# EAGLE design G882X (EAGLE 6.6.0)
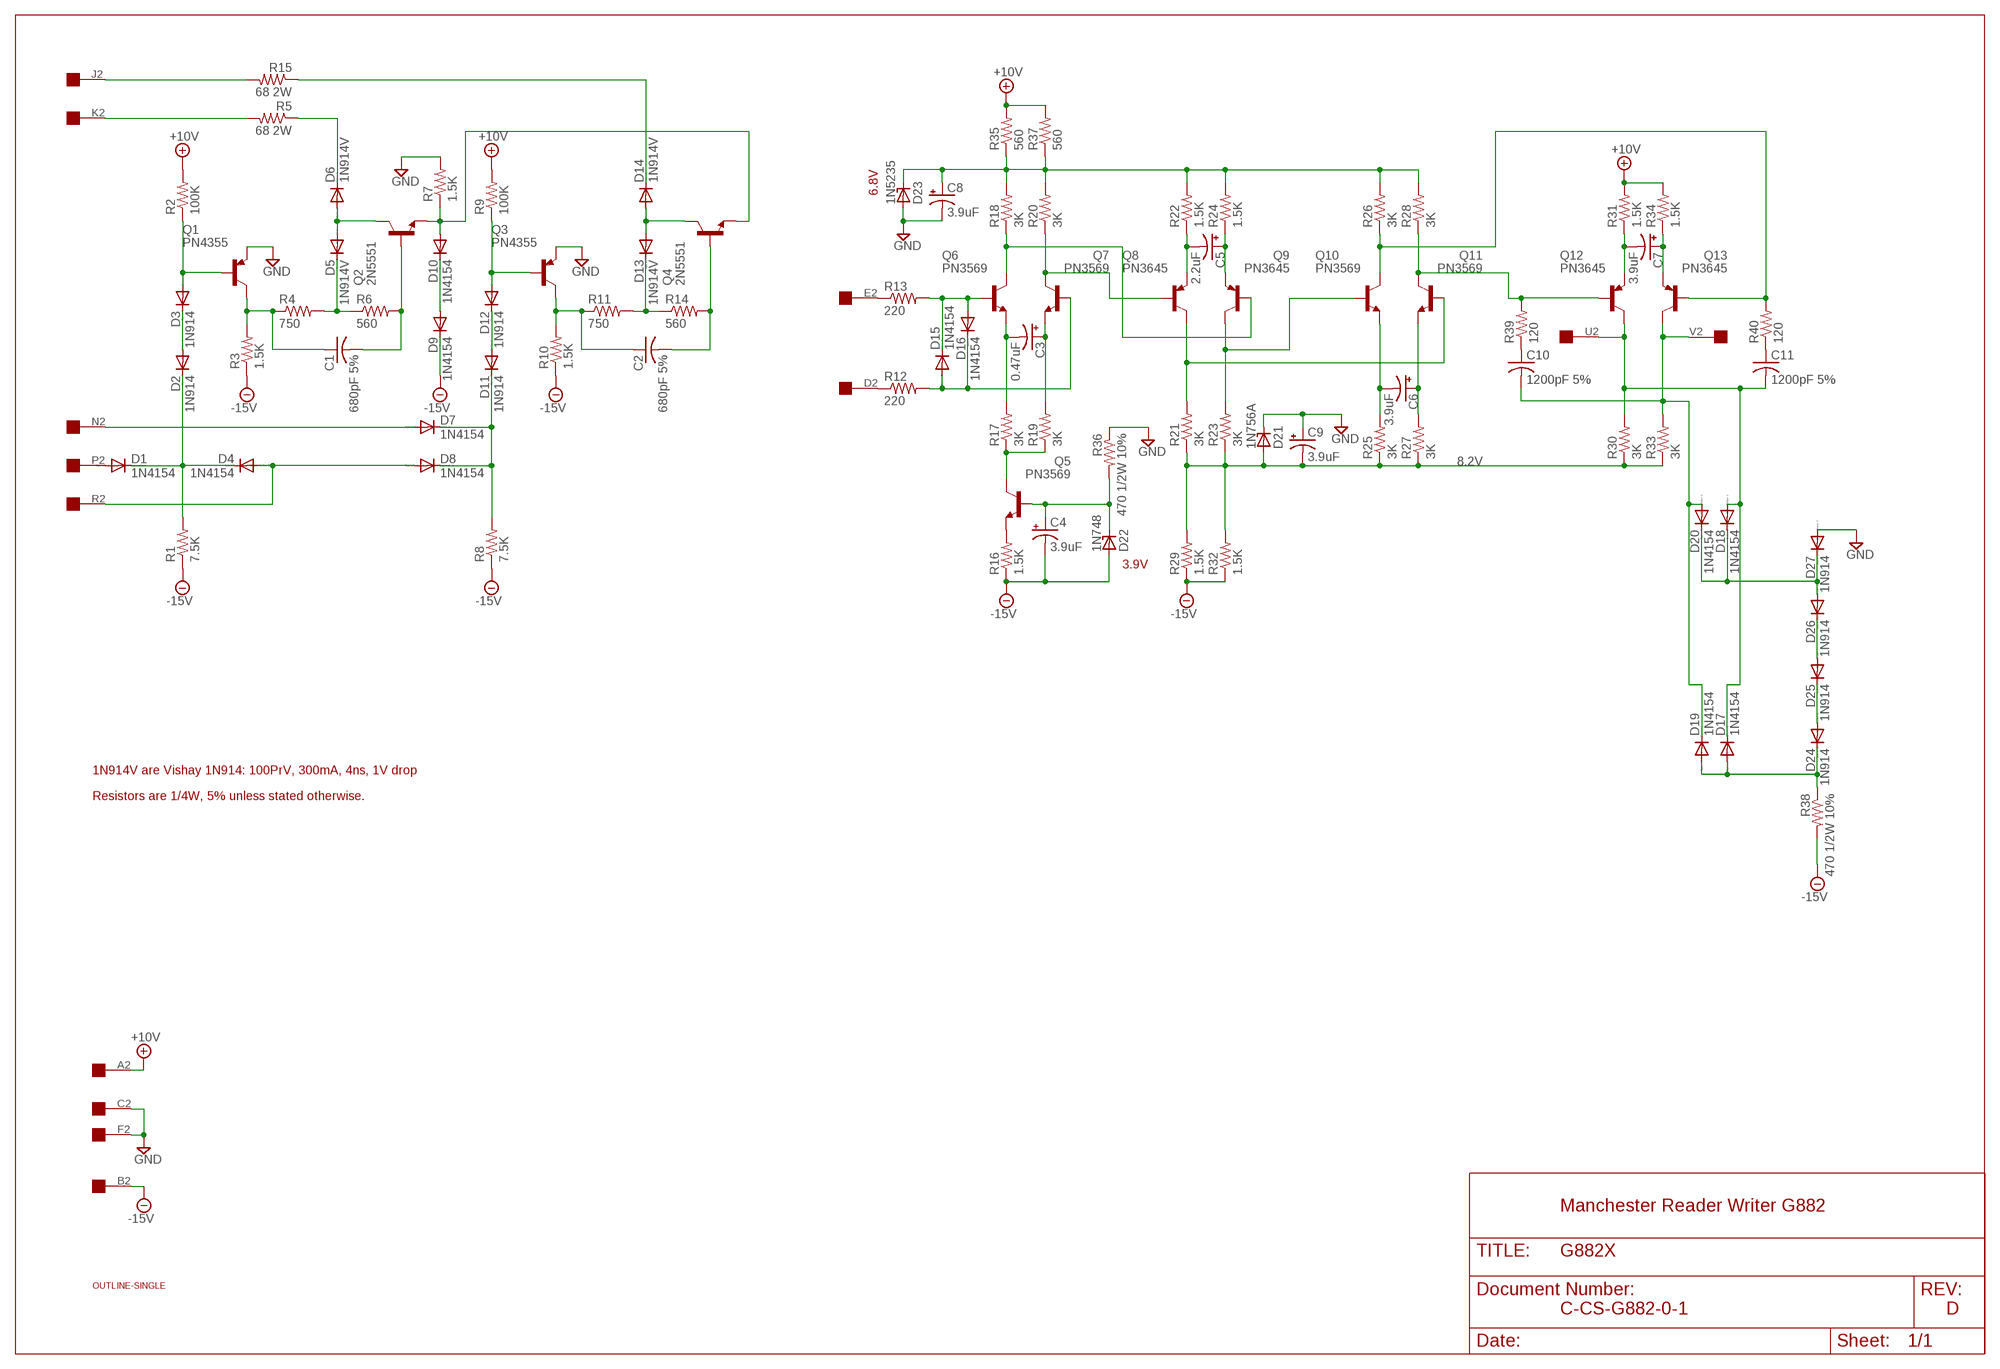
[diagram p0: schematic, sheet 1]

## Parts
C1  680pF 5%  C-US050-025X075  [C050-025X075]
C2  680pF 5%  C-US050-025X075  [C050-025X075]
C3  0.47uF  CPOL-USE12-4AXIAL  [E12-4]
C4  3.9uF  CPOL-USE12-4AXIAL  [E12-4]
C5  2.2uF  CPOL-USE12-4AXIAL  [E12-4]
C6  3.9uF  CPOL-USE12-4AXIAL  [E12-4]
C7  3.9uF  CPOL-USE12-4AXIAL  [E12-4]
C8  3.9uF  CPOL-USE12-4AXIAL  [E12-4]
C9  3.9uF  CPOL-USE12-4AXIAL  [E12-4]
C10  1200pF 5%  C-US050-025X075  [C050-025X075]
C11  1200pF 5%  C-US050-025X075  [C050-025X075]
D1  1N4154  1N4148DO35-10  [DO35-10]
D2  1N914  1N4148DO35-10  [DO35-10]
D3  1N914  1N4148DO35-10  [DO35-10]
D4  1N4154  1N4148DO35-10  [DO35-10]
D5  1N914V  1N4148DO35-10  [DO35-10]
D6  1N914V  1N4148DO35-10  [DO35-10]
D7  1N4154  1N4148DO35-10  [DO35-10]
D8  1N4154  1N4148DO35-10  [DO35-10]
D9  1N4154  1N4148DO35-10  [DO35-10]
D10  1N4154  1N4148DO35-10  [DO35-10]
D11  1N914  1N4148DO35-10  [DO35-10]
D12  1N914  1N4148DO35-10  [DO35-10]
D13  1N914V  1N4148DO35-10  [DO35-10]
D14  1N914V  1N4148DO35-10  [DO35-10]
D15  1N4154  1N4148DO35-10  [DO35-10]
D16  1N4154  1N4148DO35-10  [DO35-10]
D17  1N4154  1N4148DO35-10  [DO35-10]
D18  1N4154  1N4148DO35-10  [DO35-10]
D19  1N4154  1N4148DO35-10  [DO35-10]
D20  1N4154  1N4148DO35-10  [DO35-10]
D21  1N756A  ZENER-DIODEDO35Z10  [DO35Z10]
D22  1N748  ZENER-DIODEDO35Z10  [DO35Z10]
D23  1N5235  ZENER-DIODEDO35Z10  [DO35Z10]
D24  1N914  1N4148DO35-10  [DO35-10]
D25  1N914  1N4148DO35-10  [DO35-10]
D26  1N914  1N4148DO35-10  [DO35-10]
D27  1N914  1N4148DO35-10  [DO35-10]
Q1  PN4355  2N3635  [TO39]
Q2  2N5551  2N2102  [TO5]
Q3  PN4355  2N3635  [TO39]
Q4  2N5551  2N2102  [TO5]
Q5  PN3569  2N2102  [TO5]
Q6  PN3569  2N2102  [TO5]
Q7  PN3569  2N2102  [TO5]
Q8  PN3645  2N3635  [TO39]
Q9  PN3645  2N3635  [TO39]
Q10  PN3569  2N2102  [TO5]
Q11  PN3569  2N2102  [TO5]
Q12  PN3645  2N3635  [TO39]
Q13  PN3645  2N3635  [TO39]
R1  7.5K  R-US_0207/10  [0207/10]
R2  100K  R-US_0207/10  [0207/10]
R3  1.5K  R-US_0207/10  [0207/10]
R4  750  R-US_0207/10  [0207/10]
R5  68 2W  R-US_0817/22  [P0817/22]
R6  560  R-US_0207/10  [0207/10]
R7  1.5K  R-US_0207/10  [0207/10]
R8  7.5K  R-US_0207/10  [0207/10]
R9  100K  R-US_0207/10  [0207/10]
R10  1.5K  R-US_0207/10  [0207/10]
R11  750  R-US_0207/10  [0207/10]
R12  220  R-US_0207/10  [0207/10]
R13  220  R-US_0207/10  [0207/10]
R14  560  R-US_0207/10  [0207/10]
R15  68 2W  R-US_0817/22  [P0817/22]
R16  1.5K  R-US_0207/10  [0207/10]
R17  3K  R-US_0207/10  [0207/10]
R18  3K  R-US_0207/10  [0207/10]
R19  3K  R-US_0207/10  [0207/10]
R20  3K  R-US_0207/10  [0207/10]
R21  3K  R-US_0207/10  [0207/10]
R22  1.5K  R-US_0207/10  [0207/10]
R23  3K  R-US_0207/10  [0207/10]
R24  1.5K  R-US_0207/10  [0207/10]
R25  3K  R-US_0207/10  [0207/10]
R26  3K  R-US_0207/10  [0207/10]
R27  3K  R-US_0207/10  [0207/10]
R28  3K  R-US_0207/10  [0207/10]
R29  1.5K  R-US_0207/10  [0207/10]
R30  3K  R-US_0207/10  [0207/10]
R31  1.5K  R-US_0207/10  [0207/10]
R32  1.5K  R-US_0207/10  [0207/10]
R33  3K  R-US_0207/10  [0207/10]
R34  1.5K  R-US_0207/10  [0207/10]
R35  560  R-US_0207/10  [0207/10]
R36  470 1/2W 10%  R-US_0309/12  [0309/12]
R37  560  R-US_0207/10  [0207/10]
R38  470 1/2W 10%  R-US_0309/12  [0309/12]
R39  120  R-US_0207/10  [0207/10]
R40  120  R-US_0207/10  [0207/10]
U$1  OUTLINE-SINGLE  [SINGLE]
U$2  EDGE-1  [EDGE-CON1]

## Nets
8.2V: C9.- D21.A R21.1 R23.1 R25.1 R27.1 R29.2 R30.1 R32.2 R33.1
+10V [Supply]: R2.2 R9.2 R31.2 R34.2 R35.2 R37.2 U$2.A2
-15V [Supply]: C4.- D9.C D22.A R1.1 R3.1 R8.1 R10.1 R16.1 R29.1 R32.1 R38.2 U$2.B2
GND [Supply]: C8.- C9.+ D21.C D23.A D27.A Q1.1(E) Q3.1(E) R7.2 R36.1 U$2.C2 U$2.F2
N$1: D1.A U$2.P2
N$2: D11.A D12.C
N$3: D4.A D8.A U$2.R2
N$4: D7.A U$2.N2
N$5: C1.1 Q1.3(C) R3.2 R4.1
N$6: D1.C D2.C D4.C R1.2
N$7: D5.C R4.2 R6.1
N$8: D7.C D8.C D11.C R8.2
N$9: D12.A Q3.2(B) R9.1
N$10: D2.A D3.C
N$11: D5.A D6.A Q2.3(C)
N$12: R5.2 U$2.K2
N$13: D6.C R5.1
N$14: D3.A Q1.2(B) R2.1
N$15: C1.2 Q2.2(B) R6.2
N$16: D10.A Q2.1(E) Q4.1(E) R7.1
N$17: D9.A D10.C
N$18: R15.2 U$2.J2
N$19: C2.1 Q3.3(C) R10.2 R11.1
N$20: D13.C R11.2 R14.1
N$21: D13.A D14.A Q4.3(C)
N$22: D14.C R15.1
N$23: C2.2 Q4.2(B) R14.2
N$24: R13.1 U$2.E2
N$25: R12.1 U$2.D2
N$26: D15.A D16.C Q7.2(B) R12.2
N$27: D15.C D16.A Q6.2(B) R13.2
N$28: C3.- Q6.1(E) R17.2
N$29: C3.+ Q7.1(E) R19.2
N$30: Q5.3(C) R17.1 R19.1
N$31: Q5.1(E) R16.2
N$32: C4.+ D22.C Q5.2(B) R36.2
N$33: C8.+ D23.C R18.2 R20.2 R22.2 R24.2 R26.2 R28.2 R35.1 R37.1
N$34: C5.- Q8.1(E) R22.1
N$35: Q7.3(C) Q8.2(B) R20.1
N$36: Q6.3(C) Q9.2(B) R18.1
N$37: C5.+ Q9.1(E) R24.1
N$38: Q8.3(C) Q11.2(B) R21.2
N$39: Q9.3(C) Q10.2(B) R23.2
N$41: C6.- Q10.1(E) R25.2
N$42: C6.+ Q11.1(E) R27.2
N$43: Q11.3(C) Q12.2(B) R28.1 R39.2
N$44: Q10.3(C) Q13.2(B) R26.1 R40.2
N$45: C7.- Q12.1(E) R31.1
N$46: C7.+ Q13.1(E) R34.1
N$47: C11.2 D17.C D18.A Q12.3(C) R30.2 U$2.U2
N$48: C10.2 D19.C D20.A Q13.3(C) R33.2 U$2.V2
N$49: D17.A D19.A D24.C R38.1
N$50: D24.A D25.C
N$51: D25.A D26.C
N$52: D18.C D20.C D26.A D27.C
N$53: C10.1 R39.1
N$55: C11.1 R40.1
Unconnected: U$2.H2 U$2.L2 U$2.M2 U$2.S2 U$2.T2

## Notes on the sheet
- 6.8V
- 3.9V
- 1N914V are Vishay 1N914: 100PrV, 300mA, 4ns, 1V drop
- Resistors are 1/4W, 5% unless stated otherwise.
- Manchester Reader Writer G882
- C-CS-G882-0-1 | D

## Library data of the parts
C1 C2 C10 C11 = rcl:C-US: CAPACITOR, American symbol
C3-C9 = dec-con:CPOL-USE12-4AXIAL: 0.5" veresion of an electrolytic
D1-D20 D24-D27 = diode:1N4148: DIODE high speed (Philips)
D21-D23 = diode:ZENER-DIODE: Z-Diode
Q1 Q3 Q8 Q9 Q12 Q13 = transistor-pnp:2N3635*: PNP Transistror
Q2 Q4-Q7 Q10 Q11 = transistor-npn:2N2102: NPN Transistor
R1-R40 = rcl:R-US_: RESISTOR, American symbol
U$1 = dec-con:OUTLINE-*: Board outlines for DEC boards.
U$2 = dec-con:EDGE-1: Single-Sided DEC Edge Connector -- (side 2)

## Net classes
1 Supply: width 0.813 mm

## Board
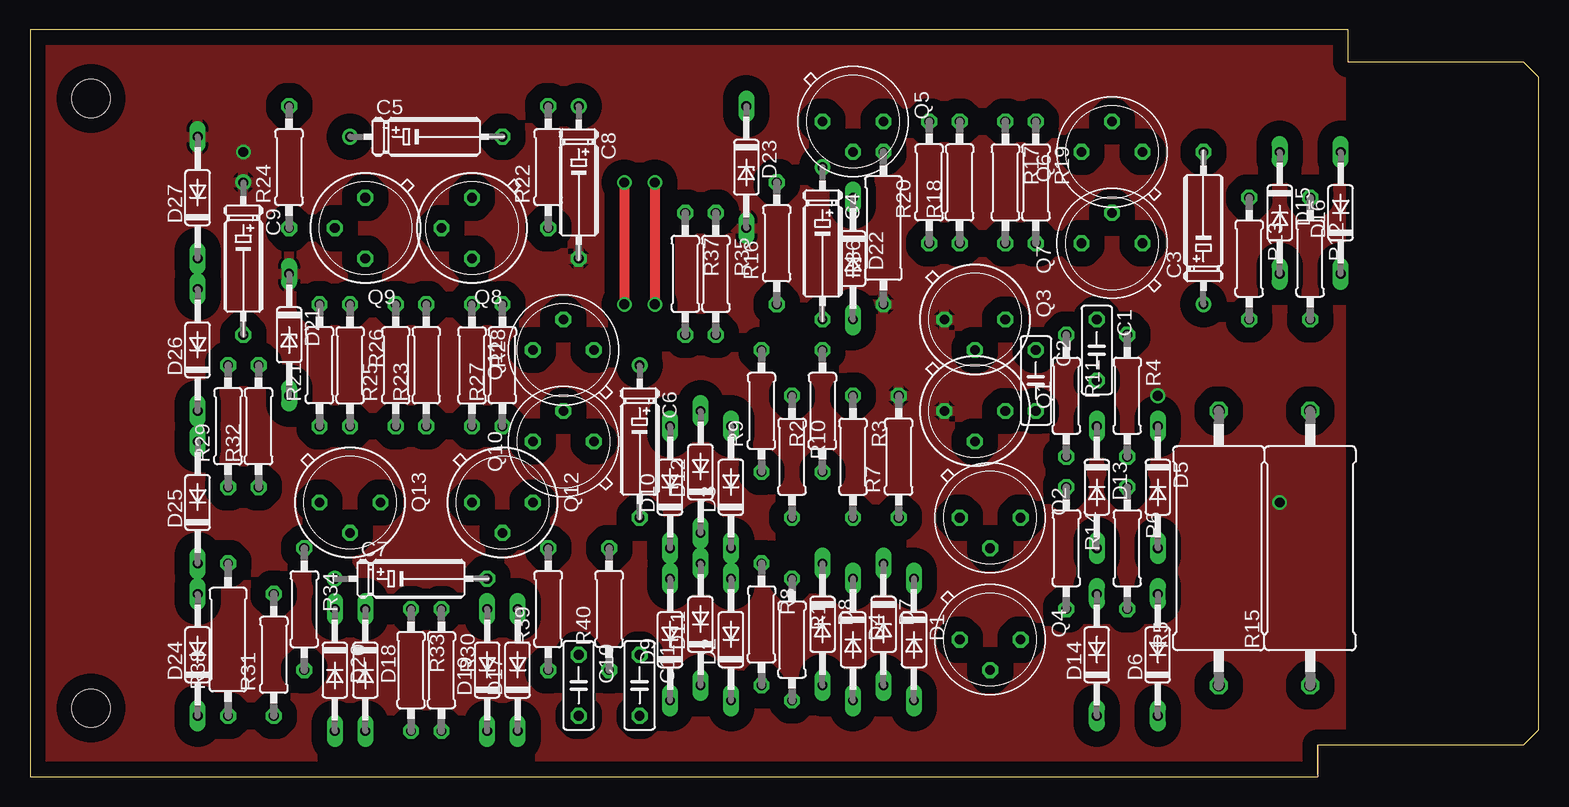
[diagram p1: board, top side]
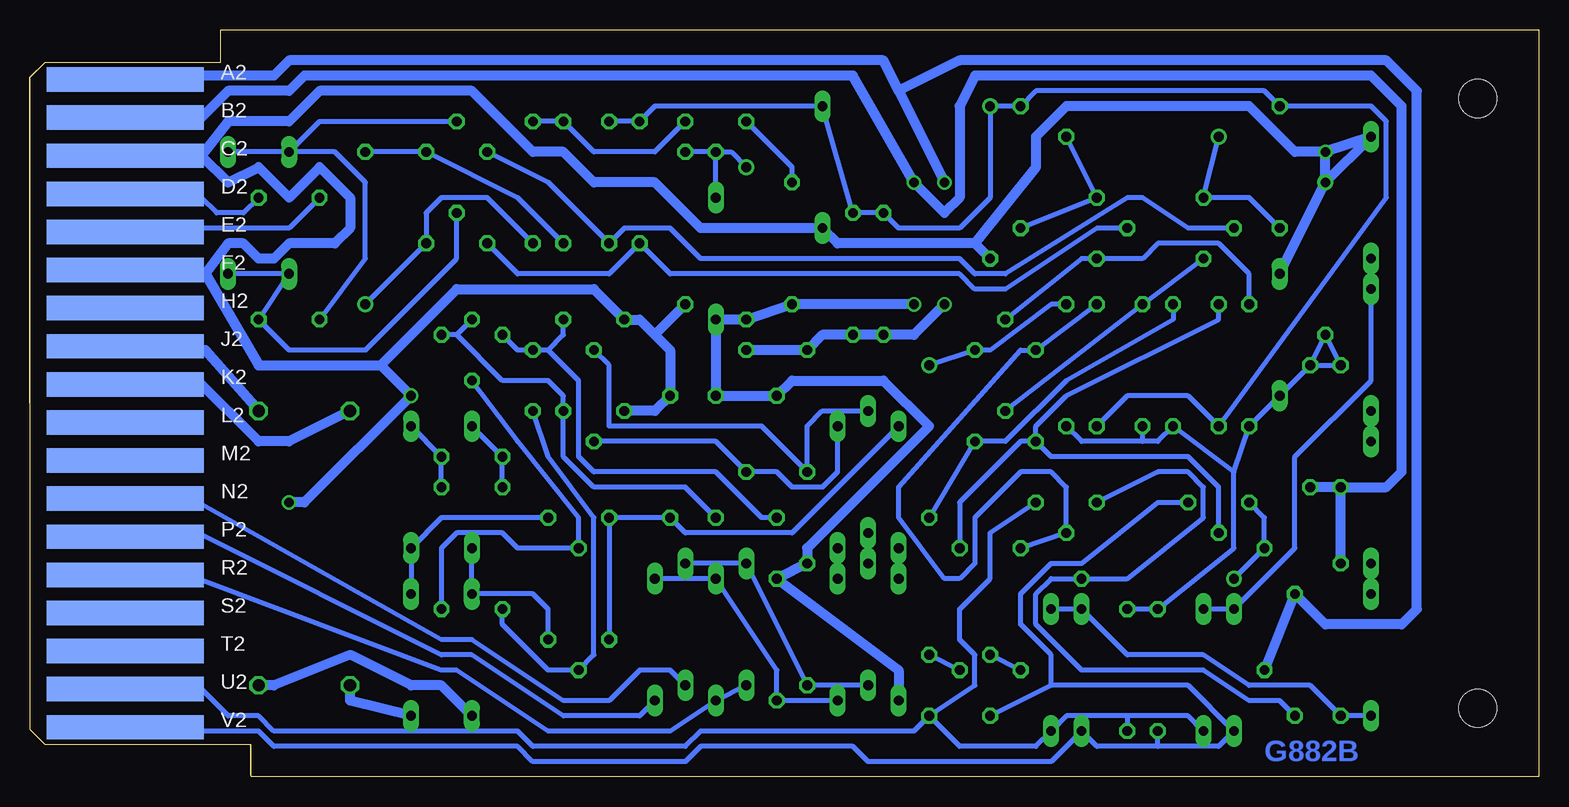
[diagram p2: board, bottom side, seen from below]

Size 125.73 x 62.23 mm. Coordinates in mm from the lower left corner, seen from the top.
Copper layers (1+16): Top 0.035mm / dielectric 1.5mm / Bottom 0.035mm
Design rules "16mils": minimum track width 16mil, minimum drill 32mil, track to track 15mil, track to pad 10mil, pad to pad 10mil, via to via 10mil, smd to smd 10mil, copper to edge 13mil, drill to drill 10mil, minimum pad ring 10mil, minimum via ring 8mil, stop-mask expansion 0mil, vias tented up to drill 0mil, thermal gap 10mil

### Footprints (pad centres in the part's own frame; a part is rotated, then mirrored left to right if it is on the bottom)
C050-025X075 = drill 0.813 octagon: 1 -2.54,0; 2 2.54,0
E12-4 = drill 0.813: + -7.62,0 | drill 0.813 octagon: - 5.08,0
DO35-10 = drill 0.813 long: A 5.08,0; C -5.08,0
DO35Z10 = drill 0.813 long: A 5.08,0; C -5.08,0
TO39 = drill 0.813 octagon: 1 0,-2.54; 2 2.54,0; 3 0,2.54
TO5 = drill 0.813 octagon: 1 0,-2.54; 2 2.54,0; 3 0,2.54
0207/10 = drill 0.813 octagon: 1 -5.08,0; 2 5.08,0
P0817/22 = drill 1.016 octagon: 1 -11.43,0; 2 11.43,0
0309/12 = drill 0.813 octagon: 1 -6.35,0; 2 6.35,0
SINGLE = hole 3.175: 120.65,56.515; 120.65,5.715
EDGE-CON1 = smd 13.106 x 2.032 bottom: A2 7.938,4.128; B2 7.938,7.303; C2 7.938,10.477; D2 7.938,13.652; E2 7.938,16.828; F2 7.938,20.003; H2 7.938,23.177; J2 7.938,26.352; K2 7.938,29.527; L2 7.938,32.703; M2 7.938,35.877; N2 7.938,39.053; P2 7.938,42.227; R2 7.938,45.403; S2 7.938,48.578; T2 7.938,51.752; U2 7.938,54.928; V2 7.938,58.102

### Placement (x,y rotation side)
C1  88.9,35.56 270 top
C2  83.82,33.02 270 top
C3  97.79,46.99 90 top
C4  66.04,43.18 270 top
C5  34.29,53.34 0 top
C6  50.8,26.67 270 top
C7  33.02,16.51 0 top
C8  45.72,48.26 270 top
C9  17.78,41.91 270 top
C10  45.72,7.62 270 top
C11  50.8,7.62 270 top
D1  73.66,11.43 270 top
D2  58.42,11.43 90 top
D3  58.42,24.13 90 top
D4  68.58,11.43 270 top
D5  93.98,24.13 270 top
D6  93.98,10.16 90 top
D7  71.12,12.7 270 top
D8  66.04,12.7 270 top
D9  53.34,11.43 90 top
D10  53.34,24.13 90 top
D11  55.88,12.7 90 top
D12  55.88,25.4 90 top
D13  88.9,24.13 270 top
D14  88.9,10.16 90 top
D15  104.14,46.99 270 top
D16  109.22,46.99 90 top
D17  40.64,8.89 90 top
D18  27.94,8.89 270 top
D19  38.1,8.89 90 top
D20  25.4,8.89 270 top
D21  21.59,36.83 270 top
D22  68.58,43.18 270 top
D23  59.69,50.8 270 top
D24  13.97,10.16 90 top
D25  13.97,22.86 90 top
D26  13.97,35.56 90 top
D27  13.97,48.26 90 top
Q1  78.74,30.48 270 top
Q2  80.01,21.59 270 top
Q3  78.74,38.1 270 top
Q4  80.01,11.43 270 top
Q5  68.58,54.61 270 top
Q6  90.17,52.07 90 top
Q7  90.17,44.45 90 top
Q8  36.83,45.72 180 top
Q9  27.94,45.72 180 top
Q10  44.45,27.94 90 top
Q11  44.45,35.56 90 top
Q12  39.37,22.86 270 top
Q13  26.67,22.86 270 top
R1  63.5,11.43 270 top
R2  66.04,30.48 90 top
R3  68.58,26.67 270 top
R4  91.44,31.75 270 top
R5  99.06,19.05 90 top
R6  91.44,19.05 270 top
R7  72.39,26.67 90 top
R8  60.96,12.7 270 top
R9  60.96,30.48 90 top
R10  63.5,26.67 270 top
R11  86.36,31.75 270 top
R12  106.68,43.18 270 top
R13  101.6,43.18 270 top
R14  86.36,19.05 270 top
R15  106.68,19.05 90 top
R16  62.23,44.45 90 top
R17  81.28,49.53 270 top
R18  77.47,49.53 90 top
R19  83.82,49.53 270 top
R20  74.93,49.53 90 top
R21  24.13,34.29 90 top
R22  43.18,50.8 90 top
R23  33.02,34.29 90 top
R24  21.59,50.8 90 top
R25  30.48,34.29 90 top
R26  26.67,34.29 270 top
R27  39.37,34.29 90 top
R28  36.83,34.29 270 top
R29  16.51,29.21 90 top
R30  34.29,8.89 270 top
R31  20.32,10.16 90 top
R32  19.05,29.21 90 top
R33  31.75,8.89 270 top
R34  22.86,13.97 270 top
R35  57.15,41.91 270 top
R36  71.12,45.72 90 top
R37  54.61,41.91 270 top
R38  16.51,11.43 90 top
R39  43.18,13.97 90 top
R40  48.26,13.97 90 top
U$1  125.73,62.23 180 top
U$2  125.73,62.23 180 top

### Tracks (layer width: path | path; a pad name or v marks a point on that pad's centre or on a via)
8.2V
  Bottom 0.406: R30.1 R33.1 25.4,19.05 25.4,25.4 | 25.4,25.4 R25.1 31.75,27.94 33.02,27.94 | 25.4,25.4 R21.1 D21.A R32.2 | R32.2 R29.2 C9.- R32.2 | R27.1 38.1,27.94 33.02,27.94 | 33.02,27.94 R23.1
+10V  (via drill 0.81)
  Top 0.813: v49.53,49.53 v49.53,39.37
  Bottom 0.813: R2.2 R9.2 59.69,36.83 R35.2 R37.2 52.07,36.83 v49.53,39.37 | U$2.A2 117.22,58.04 116.84,58.42 105.41,58.42 104.14,59.69 54.61,59.69 53.34,57.15 | 53.34,57.15 v49.53,49.53 | R34.2 R31.2 17.78,12.7 11.43,12.7 10.16,13.97 10.16,57.15 12.7,59.69 48.26,59.69 53.34,57.15
-15V  (via drill 0.81)
  Top 0.813: v52.07,49.53 v52.07,39.37
  Bottom 0.813: D9.C 53.34,8.89 R1.1 R8.1 60.96,19.05 50.8,29.21 54.61,33.02 62.23,33.02 R10.1 R3.1 D22.A C4.- R16.1 v52.07,39.37 | U$2.B2 117.13,54.9 116.84,54.61 111.76,54.61 109.22,57.15 104.14,57.15 102.87,58.42 57.15,58.42 v52.07,49.53 49.53,46.99 48.26,48.26 48.26,55.88 46.99,58.42 13.97,58.42 11.43,55.88 11.43,25.4 12.7,24.13 R29.1 | R29.1 R32.1 | R38.2 R29.1
GND  (via drill 0.81)
  Bottom 0.813: 73.66,36.83 74.93,38.1 Q3.1 78.74,40.64 90.17,40.64 96.52,34.29 | 73.66,36.83 72.39,35.56 R7.2 73.66,30.48 Q1.1 | v104.14,22.86 102.87,22.86 v93.98,31.75 96.52,34.29 | U$2.F2 117.12,42.19 116.84,41.91 111.12,41.91 | 111.12,41.91 106.68,34.29 96.52,34.29 | U$2.C2 117.17,51.74 116.84,52.07 111.44,51.75 | 111.44,51.75 109.22,49.53 106.68,50.8 104.14,48.26 101.6,50.8 99.06,48.26 99.06,45.72 100.33,44.45 104.14,44.45 105.41,43.18 106.68,43.18 107.95,44.45 109.22,44.45 111.12,41.91 | 111.44,51.75 109.22,54.61 104.14,54.61 101.6,57.15 88.9,57.15 83.82,52.07 81.28,52.07 78.74,49.53 73.66,49.53 69.85,45.72 D23.A 58.42,44.45 46.99,44.45 | 46.99,44.45 C8.- | v17.78,52.07 D27.A C9.+ | D21.C C9.+ | 46.99,44.45 41.91,50.8 41.91,53.34 39.37,55.88 24.13,55.88 20.32,52.07 v17.78,52.07 | C9.+ v17.78,52.07 | 73.66,36.83 R36.1
  pour Top (isolate 1.27): 0,62.23 109.22,62.23 109.22,0 0,0
N$1
  Bottom 0.406: D1.A 74.93,5.08 81.28,5.08 88.9,10.16 91.44,10.16 111.76,20.32 116.84,20.32 U$2.P2
N$2
  Bottom 0.406: D11.A D12.C
N$3
  Bottom 0.406: D8.A D4.A 72.39,3.81 82.55,3.81 90.17,8.89 91.44,8.89 111.76,16.51 116.84,16.51 117.17,16.84 U$2.R2
N$4
  Bottom 0.406: D7.A 72.39,8.89 74.93,8.89 77.47,6.35 81.28,6.35 88.9,11.43 91.44,11.43 111.76,22.86 116.84,22.86 117.17,23.19 U$2.N2
N$5
  Bottom 0.406: R3.2 71.12,24.13 78.74,24.13 81.28,26.67 Q1.3 81.28,31.75 82.55,33.02 86.36,33.02 90.17,36.83 | 90.17,36.83 R4.1 | 90.17,36.83 C1.1
N$6
  Bottom 0.406: D2.C R1.2 63.5,8.89 D4.C D1.C
N$7
  Bottom 0.406: R6.1 R4.2 D5.C
N$8
  Bottom 0.406: D7.C D8.C R8.2 D11.C
N$9
  Bottom 0.406: D12.A 59.69,30.48 60.96,29.21 R9.1 64.77,29.21 77.47,29.21 77.47,34.29 Q3.2
N$10
  Bottom 0.406: D2.A D3.C
N$11
  Bottom 0.406: D6.A D5.A 91.44,21.59 Q2.3
N$12
  Bottom 0.813: U$2.K2 117.14,32.72 116.84,33.02 111.76,33.02 106.68,27.94 104.14,27.94 R5.2
N$13
  Bottom 0.813: D6.C 99.06,6.35 R5.1
N$14
  Bottom 0.406: D3.A 58.42,25.4 59.69,24.13 62.23,24.13 63.5,25.4 R2.1 68.58,27.94 Q1.2
N$15
  Bottom 0.406: R6.2 91.44,19.05 90.17,20.32 86.36,20.32 85.09,19.05 Q2.2 80.01,21.59 85.09,27.94 C1.2
N$16
  Bottom 0.406: D10.A 62.23,20.32 71.12,20.32 R7.1 Q2.1 Q4.1
N$17
  Bottom 0.406: D9.A D10.C
N$18
  Bottom 0.813: U$2.J2 116.84,35.89 116.84,35.56 111.12,35.56 R15.2
N$19
  Bottom 0.406: R10.2 64.77,21.59 68.58,25.4 78.74,25.4 80.01,26.67 80.01,33.02 82.55,35.56 | 82.55,35.56 C2.1 85.09,35.56 R11.1 | Q3.3 81.28,36.83 82.55,35.56
N$20
  Bottom 0.406: R14.1 R11.2 D13.C
N$21
  Bottom 0.406: Q4.3 82.55,13.97 83.82,15.24 D14.A D13.A
N$22
  Bottom 0.813: D14.C 91.44,7.62 93.98,7.62 99.06,10.16 105.41,7.62 R15.1
N$23
  Bottom 0.406: C2.2 82.55,26.67 78.74,21.59 78.74,10.16 Q4.2 82.55,8.89 86.36,12.7 R14.2
N$24
  Bottom 0.406: U$2.E2 117.17,45.39 116.84,45.72 104.14,45.72 R13.1
N$25
  Bottom 0.406: U$2.D2 117.14,48.56 116.84,48.26 111.44,48.26 110.17,46.99 107.95,46.99 R12.1
N$26
  Bottom 0.406: Q7.2 90.17,43.18 97.79,35.56 104.14,35.56 R12.2 D15.A D16.C
N$27
  Bottom 0.406: Q6.2 101.6,54.61 D15.C | R13.2 97.79,43.18 97.79,49.53 100.33,52.07 D15.C | D15.C D16.A
N$28
  Bottom 0.406: R17.2 85.09,48.26 Q6.1 C3.-
N$29
  Bottom 0.406: C3.+ Q7.1 92.71,46.99 91.44,48.26 87.63,48.26 R19.2
N$30
  Bottom 0.406: Q5.3 73.66,52.07 78.74,52.07 R17.1 R19.1
N$31
  Bottom 0.406: Q5.1 62.23,50.8 R16.2
N$32
  Bottom 0.406: D22.C Q5.2 | Q5.2 R36.2 | Q5.2 67.31,52.07 C4.+
N$33
  Bottom 0.406: R18.2 R20.2 73.66,55.88 D23.C R35.1 R37.1 53.34,45.72 48.26,45.72 45.72,48.26 C8.+ R22.2 41.91,57.15 22.86,57.15 R24.2 13.97,55.88 12.7,54.61 12.7,48.26 R26.2 29.21,31.75 34.29,31.75 R28.2
N$34
  Bottom 0.406: C5.- Q8.1 R22.1
N$35
  Bottom 0.406: Q7.3 85.09,41.91 77.47,41.91 R20.1 72.39,41.91 48.26,41.91 46.99,40.64 44.45,40.64 36.83,45.72 Q8.2
N$36
  Bottom 0.406: Q6.3 82.55,49.53 R18.1 76.2,45.72 72.39,45.72 69.85,43.18 48.26,43.18 46.99,41.91 44.45,41.91 34.29,48.26 33.02,48.26 29.21,45.72 Q9.2
N$37
  Bottom 0.406: R24.1 24.13,48.26 Q9.1 C5.+
N$38
  Bottom 0.406: Q11.2 38.1,43.18 Q8.3 33.02,43.18 31.75,44.45 26.67,44.45 24.13,41.91 R21.2
N$39
  Bottom 0.406: Q9.3 R23.2 Q10.2
N$41
  Bottom 0.406: R25.2 30.48,38.1 39.37,33.02 44.45,27.94 Q10.1 C6.-
N$42
  Bottom 0.406: R27.2 40.64,39.37 45.72,35.56 Q11.1 C6.+
N$43
  Bottom 0.406: R28.1 Q11.3 43.18,35.56 53.34,24.13 53.34,21.59 49.53,16.51 48.26,16.51 46.99,17.78 46.99,21.59 43.18,25.4 40.64,25.4 39.37,24.13 Q12.2 R39.2
N$44
  Bottom 0.406: R26.1 26.67,38.1 39.37,31.75 41.91,29.21 Q10.3 | R40.2 48.26,22.86 43.18,27.94 Q10.3 | Q10.3 40.64,26.67 29.21,26.67 26.67,24.13 Q13.2
N$45
  Bottom 0.406: R31.1 21.59,6.35 24.13,6.35 27.94,8.89 38.1,8.89 41.91,12.7 41.91,15.24 40.64,16.51 C7.- 34.29,16.51 27.94,21.59 27.94,24.13 29.21,25.4 31.75,25.4 Q12.1
N$46
  Bottom 0.406: C7.+ R34.1 22.86,21.59 Q13.1
N$47
  Bottom 0.406: U$2.U2 117.2,7.26 116.84,7.62 111.76,7.62 109.22,5.08 106.68,5.08 105.41,3.81 85.09,3.81 83.82,2.54 71.12,2.54 69.85,3.81 52.07,3.81 C11.2 | C11.2 48.26,2.54 41.91,2.54 D17.C 39.37,5.08 34.29,5.08 | 34.29,5.08 R30.2 | D18.A 29.21,5.08 34.29,5.08 | Q12.3 45.72,20.32 45.72,16.51 48.26,13.97 48.26,11.43 46.99,10.16 46.99,7.62 C11.2
N$48
  Bottom 0.406: U$2.V2 117.16,4.13 116.84,3.81 106.68,3.81 105.41,2.54 85.09,2.54 83.82,1.27 71.12,1.27 69.85,2.54 57.15,2.54 55.88,1.27 40.64,1.27 D19.C 36.83,2.54 31.75,2.54 | 31.75,2.54 R33.2 | 31.75,2.54 26.67,2.54 D20.A 29.21,7.62 40.64,7.62 | Q13.3 31.75,22.86 38.1,17.78 40.64,17.78 43.18,15.24 43.18,12.7 40.64,10.16 40.64,7.62 | 40.64,7.62 C10.2
N$49
  Bottom 0.406: D17.A D19.A 34.29,10.16 27.94,10.16 24.13,7.62 19.05,7.62 R38.1 D24.C
N$50
  Bottom 0.406: D24.A D25.C
N$51
  Bottom 0.406: D25.A D26.C
N$52
  Bottom 0.406: D18.C D20.C 20.32,19.05 20.32,26.67 13.97,33.02 D26.A D27.C
N$53
  Bottom 0.406: R39.1 C10.1
N$55
  Bottom 0.406: R40.1 C11.1

### Text on the board
Bottom: G882B